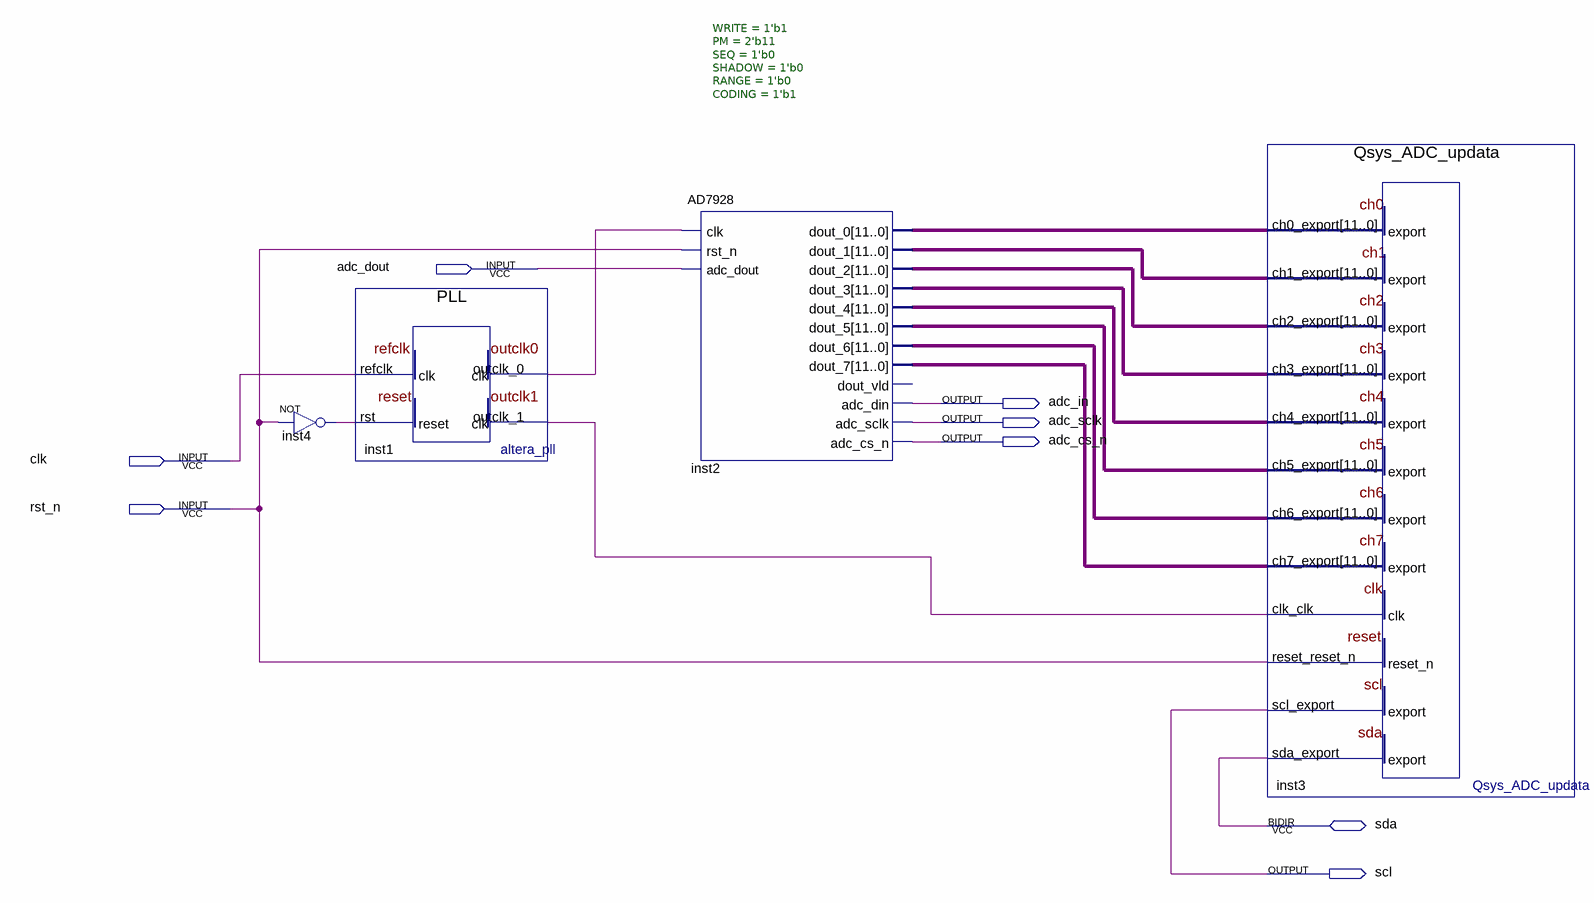
[diagram p0: schematic sheet]
// Quartus schematic Qsys_ADC_update.bdf as structural Verilog: 4 symbols, 8 pins
module Qsys_ADC_update (
  input  adc_dout,
  input  clk,
  input  rst_n,
  inout  sda,
  output adc_in,
  output adc_sclk,
  output adc_cs_n,
  output scl
);

  wire inst1_outclk_0, inst1_outclk_1, inst4_out;
  wire [11:0] inst2_dout_0, inst2_dout_1, inst2_dout_2, inst2_dout_3, inst2_dout_4, inst2_dout_5,
       inst2_dout_6, inst2_dout_7;

  not inst4 (inst4_out, rst_n);
  PLL inst1 (.refclk(clk), .rst(inst4_out), .outclk_0(inst1_outclk_0), .outclk_1(inst1_outclk_1));
  AD7928 #(.WRITE(1'b1), .PM(2'b11), .SEQ(1'b0), .SHADOW(1'b0), .RANGE(1'b0), .CODING(1'b1)) inst2 (
    .clk(inst1_outclk_0), .rst_n(rst_n), .adc_dout(adc_dout), .dout_0(inst2_dout_0), .dout_1(inst2_dout_1),
    .dout_2(inst2_dout_2), .dout_3(inst2_dout_3), .dout_4(inst2_dout_4), .dout_5(inst2_dout_5),
    .dout_6(inst2_dout_6), .dout_7(inst2_dout_7), .adc_din(adc_in), .adc_sclk(adc_sclk), .adc_cs_n(adc_cs_n));  // open: dout_vld
  Qsys_ADC_updata inst3 (
    .ch0_export(inst2_dout_0), .ch1_export(inst2_dout_1), .ch2_export(inst2_dout_2),
    .ch3_export(inst2_dout_3), .ch4_export(inst2_dout_4), .ch5_export(inst2_dout_5),
    .ch6_export(inst2_dout_6), .ch7_export(inst2_dout_7), .clk_clk(inst1_outclk_1), .reset_reset_n(rst_n),
    .scl_export(scl), .sda_export(sda));
endmodule
